# Altium schematic sheet Peripherals.SchDoc: Peripherals
size A4; Date: Not used; ApprovedBy: Not used; CheckedBy: Not used; Author: Not used; CompanyName: STMicroelectronics; DrawnBy: Not used; Engineer: Not used; Organization: Not used; Address1: Not used; Address2: Not used; Address3: Not used; Address4: Not used; DocumentNumber: Not used; Revision: Not used; SheetNumber: 14; SheetTotal: 22; CurrentTime: Not used; CurrentDate: Not used; Time: Not used; DocumentFullPathAndName: Not used; DocumentName: Not used; ModifiedDate: Not used; ImagePath: Not used; ProjectName: Not used; Application_BuildNumber: Not used
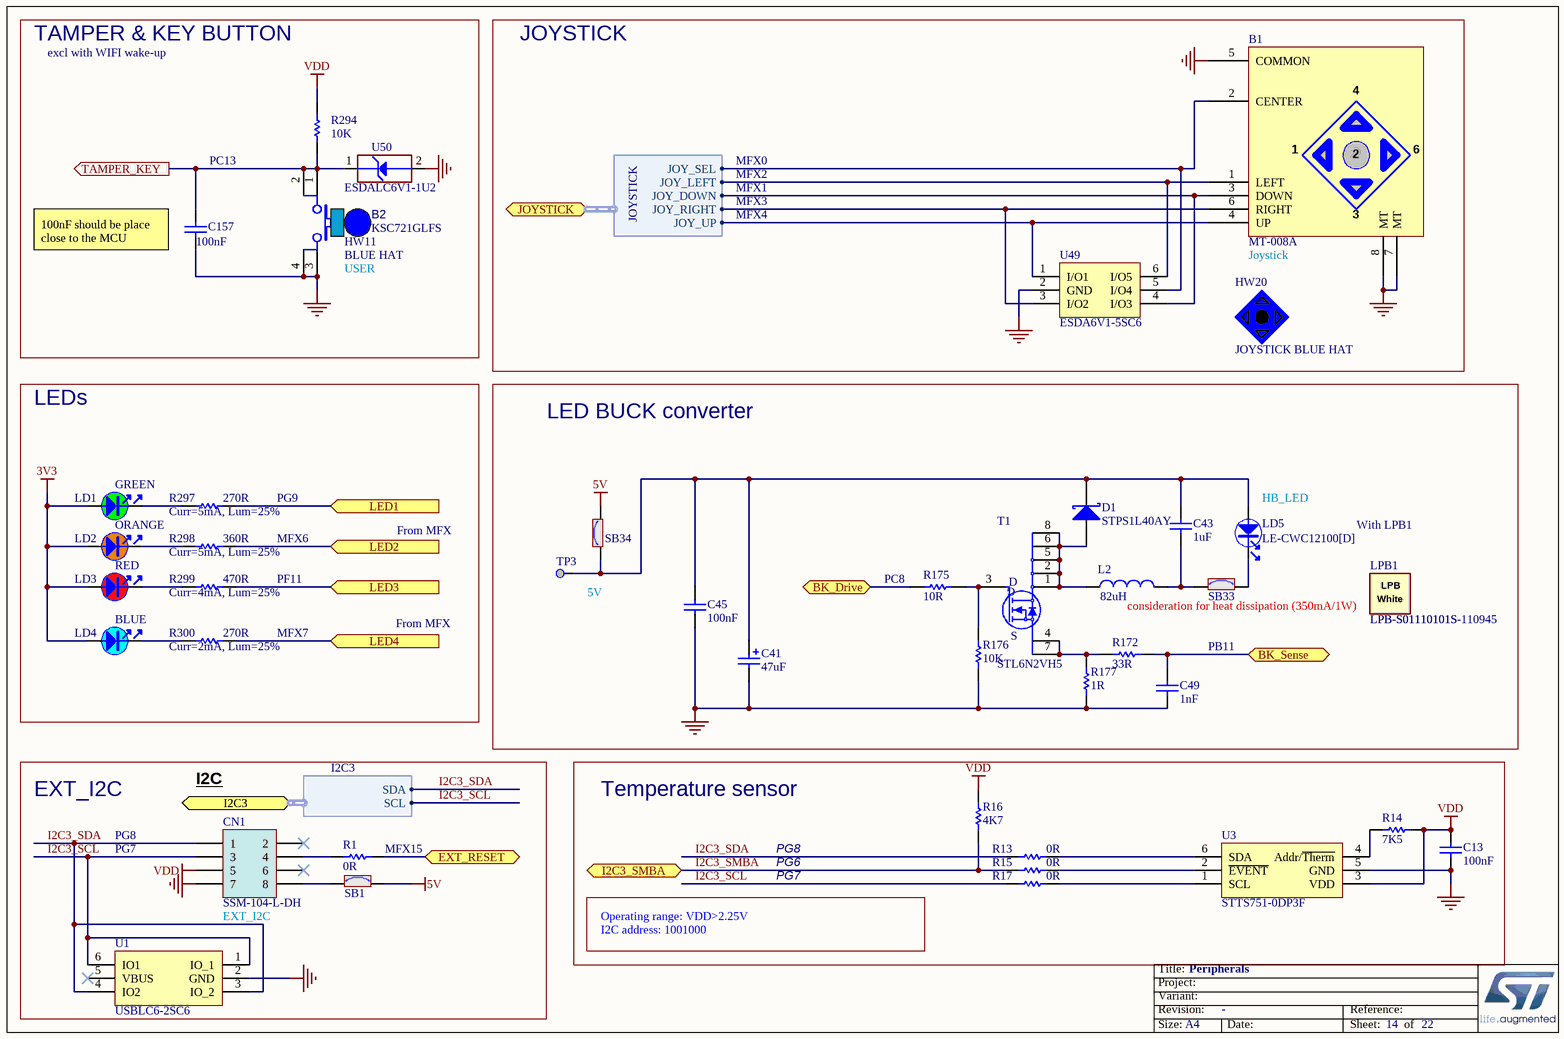
[diagram p0: Peripherals.SchDoc]

## Parts
B1  value MT-008A  [SWI_XIEJIA_MT-008A_6P]  (hidden comment: Joystick MT-008A_M)
B2  value KSC721GLFS  [SWI_C&K_KSC721GLFS_BLUE]  (hidden comment: SW_BLUE_KSC721GLFS)
C13  value 100nF  [C0603]  (hidden comment: Capacitor)
C41  value 47uF  [CPOL_TAJ-C_2312_H2P6]  (hidden comment: Cap_POL_TANA)
C43  value 1uF  [C0603]  (hidden comment: Capacitor)
C45  value 100nF  [C0603]  (hidden comment: Capacitor)
C49  value 1nF  [C0402]  (hidden comment: Capacitor)
C157  value 100nF  [C0402]  (hidden comment: Capacitor)
CN1  value SSM-104-L-DH  [CON_SAMTEC_SSM-104-L-DH]  (hidden comment: Socket 4x2)
D1  value STPS1L40AY  [DIO_SMA_1A_2K]  (hidden comment: SCHOTTKY)
HW11  value BLUE HAT  (hidden comment: BUTTON_HAT_BLUE)  (mechanical)
HW20  value JOYSTICK BLUE HAT  (hidden comment: JOYSTICK_BLUE_HAT)  (mechanical)
L2  value 82uH  [IND_POWER_CYNTEC_PSI054T]  (hidden comment: Inductor)
LD1  value GREEN  [LED_0603_OSRAM_LG-Q396-PS-35_GREEN_1A2K_H0P4]  (hidden comment: LED_green)
LD2  value ORANGE  [LED_0603_OSRAM_LO-Q976-PS-25_ORANGE_1A2K_H0P8]  (hidden comment: LED_orange)
LD3  value RED  [LED_0603_VISHAY_VLMS1300-GS08_RED_1A2K_H0P8]  (hidden comment: LED_red)
LD4  value BLUE  [LED_0603_OSRAM_LB-Q39G-L2OO-35-1_BLUE_1A2K_H0P4]  (hidden comment: LED_blue)
LD5  value LE-CWC12100[D]  [LED_EVERLUCK_CWC12100_WHITE_1A2K]  (hidden comment: LED_white)
LPB1  LPB-S01110101S  value LPB-S01110101S-110945  [LIGHT_10MM-SQUARE-LIGHT-BAR_LUMEX_LPB-S01110101S-110945]
R1  value 0R  [R0402]  (hidden comment: Resistor)
R13  value 0R  [R0603]  (hidden comment: Resistor)
R14  value 7K5  [R0603]  (hidden comment: Resistor)
R15  value 0R  [R0603]  (hidden comment: Resistor)
R16  value 4K7  [R0402]  (hidden comment: Resistor)
R17  value 0R  [R0603]  (hidden comment: Resistor)
R172  value 33R  [R0603]  (hidden comment: Resistor)
R175  value 10R  [R0805]  (hidden comment: Resistor)
R176  value 10K  [R0603]  (hidden comment: Resistor)
R177  value 1R  [R1206_H0P55]  (hidden comment: Resistor)
R294  value 10K  [R0402]  (hidden comment: Resistor)
R297  value 270R  [R0603]  (hidden comment: Resistor)
R298  value 360R  [R0603]  (hidden comment: Resistor)
R299  value 470R  [R0603]  (hidden comment: Resistor)
R300  value 270R  [R0603]  (hidden comment: Resistor)
SB1  SB_ON  [SOLDER-BRIDGE_R0603-0R]  (value not drawn)
SB33  SB_ON  [SOLDER-BRIDGE_R0603-0R]  (value not drawn)
SB34  SB_ON  [SOLDER-BRIDGE_R0603-0R]  (value not drawn)
T1  STL6N2VH5  [MOS_POWERFLAT_2X2_P065]
TP3  Test Point  [TP_SMD_1MM]  (value not drawn)  (no BOM)
U1  USBLC6-2SC6  [ESD_SOT23-6L]
U3  STTS751-0DP3F  [ICC_UDFN6_2X2_P065]
U49  ESDA6V1-5SC6  [ESD_SOT23-6L]
U50  value ESDALC6V1-1U2  [ESD_ST0201]  (hidden comment: ESD-TRANSIL)

## Blocks framed on the sheet
TAMPER & KEY BUTTON: B2 C157 HW11 R294 U50
JOYSTICK: B1 HW20 U49
LEDs: LD1-LD4 R297-R300
LED BUCK converter: C41 C43 C45 C49 D1 L2 LD5 LPB1 R172 R175-R177 SB33 SB34 T1 TP3
EXT_I2C: CN1 R1 SB1 U1
Temperature sensor: C13 R13-R17 U3

## Ports
BK_Drive, BK_Sense, EXT_RESET, I2C3 (harness I2C3), I2C3_SMBA, JOYSTICK (harness JOYSTICK), LED1 (in), LED2 (in), LED3 (in), LED4 (in), TAMPER_KEY (out)

## Harnesses
JOYSTICK: JOY_SEL, JOY_LEFT, JOY_DOWN, JOY_RIGHT, JOY_UP
I2C3: SDA, SCL

## Nets
3V3: LD1.1 LD2.1 LD3.1 LD4.1
5V: SB1.2 SB34.2
GND: B1.5(COMMON) B1.7(MT) B1.8(MT) B2.3 B2.4 C13.2 C41.2 C45.1 C49.1 C157.1 CN1.7 R176.1 R177.1 U1.2(GND) U3.5(GND) U49.2(GND) U50.2(GND)
VDD: C13.1 CN1.5 R14.2 R16.2 R294.2 U3.3(VDD)
BK_Drive: R175.1 ; port BK_Drive
BK_Sense: C49.2 R172.2 ; port BK_Sense
EXT_RESET: R1.2 ; port EXT_RESET
I2C3_SCL: CN1.3 R17.1 U1.1(IO_1) U1.6(IO1) ; port I2C3.SCL
I2C3_SDA: CN1.1 R13.1 U1.3(IO_2) U1.4(IO2) ; port I2C3.SDA
I2C3_SMBA: R15.1 R16.1 ; port I2C3_SMBA
LED1: R297.2 ; port LED1
LED2: R298.2 ; port LED2
LED3: R299.2 ; port LED3
LED4: R300.2 ; port LED4
TAMPER_KEY: B2.1 B2.2 C157.2 R294.1 U50.1(IO1) ; port TAMPER_KEY
NetB1_1: B1.1(LEFT) U49.6(I/O5) ; port JOYSTICK.JOY_LEFT
NetB1_2: B1.2(CENTER) U49.5(I/O4) ; port JOYSTICK.JOY_SEL
NetB1_3: B1.3(DOWN) U49.4(I/O3) ; port JOYSTICK.JOY_DOWN
NetB1_4: B1.4(UP) U49.1(I/O1) ; port JOYSTICK.JOY_UP
NetB1_6: B1.6(RIGHT) U49.3(I/O2) ; port JOYSTICK.JOY_RIGHT
NetC41_1: C41.1 C43.2 C45.2 D1.2(K) LD5.1 SB34.1 TP3.1
NetC43_1: C43.1 L2.2 SB33.1
NetCN1_4: CN1.4 R1.1
NetCN1_8: CN1.8 SB1.1
NetD1_1: D1.1(A) L2.1 T1.1(D) T1.2(D) T1.5(D) T1.6(D) T1.8(D)
NetLD1_2: LD1.2 R297.1
NetLD2_2: LD2.2 R298.1
NetLD3_2: LD3.2 R299.1
NetLD4_2: LD4.2 R300.1
NetLD5_2: LD5.2 SB33.2
NetR13_2: R13.2 U3.6(SDA)
NetR14_1: R14.1 U3.4(Addr/~{Therm})
NetR15_2: R15.2 U3.2(~{EVENT})
NetR17_2: R17.2 U3.1(SCL)
NetR172_1: R172.1 R177.2 T1.4(S) T1.7(S)
NetR175_2: R175.2 R176.2 T1.3(G)

Not connected (* = marked no-connect by the designer): CN1 2* 6*; U1 5(VBUS)*

## Notes on the sheet
- excl with WIFI wake-up
- PC13
- MFX2
- MFX0
- (near C157) 100nF should be place close to the MCU
- MFX1
- MFX3
- MFX4
- (near B2) USER
- (near B1) Joystick
- (near R297) Curr=5mA, Lum=25%
- PG9
- (near LD5) HB_LED
- (near R298) Curr=5mA, Lum=25%
- MFX6
- PF11
- From MFX
- (near R175) PC8
- (near LPB1) With LPB1
- (near R299) Curr=4mA, Lum=25%
- (near R300) Curr=2mA, Lum=25%
- MFX7
- 5V
- consideration for heat dissipation (350mA/1W)
- PB11
- I2C
- PG8
- PG7
- (near R1) MFX15
- EXT_I2C
- Operating range: VDD>2.25V
- PG6
- I2C address: 1001000
- Title:
- Project:
- Size:
- Revision:
- Variant:
- A4
- -
- Date:
- Reference:
- Sheet:
- of
- (in symbol MCD-01191) LPB; White

## Library data of the parts
B1 = MCD-00132: Joystick, 4 dir, 1 OK; Part_Type: Misc; Manufacturer: XIEJIA Electronics; Provided_By: SUBCO; Initial_Board_Reference: MB1262; Path: ws/MCD_ApplicationBoards/Lists/MCDPARTSdatabase; Item Type: Item; Internal_Part_Number: MCD-00132; Status: Released; Manufacturer_Part_Number: MT-008A; ComponentLink1Description: Datasheet; ComponentLink1URL: http://tunmcdsvn.tun.st.com/Component_Datasheet_Library/Trunk/Misc/Xieja electronics_MT-008A
B2 = MCD-00176: Switch HW BLUE High4.3mm 2.25 Newtons; Manufacturer: C&K; Part_Type: Misc; Provided_By: SUBCO; Initial_Board_Reference: MB1274; Path: ws/MCD_ApplicationBoards/Lists/MCDPARTSdatabase; Item Type: Item; Internal_Part_Number: MCD-00176; Manufacturer_Part_Number: KSC721GLFS; Status: Released; ComponentLink1Description: Datasheet; ComponentLink1URL: http://tunmcdsvn.tun.st.com/Component_Datasheet_Library/Trunk/Misc/C&K_tactile_switch_KSC_series
C13 C45 = MCD-00211: Capacitor, MLCC, 100nF, 16V, X7R, 10%, 0603, T=0,8mm; Manufacturer_Part_Number: CC0603KRX7R7BB104; Manufacturer: YAGEO; Provided_By: SUBCO; Initial_Board_Reference: MB1319; Path: ws/MCD_ApplicationBoards/Lists/MCDPARTSdatabase; Item Type: Item; Internal_Part_Number: MCD-00211; Status: Released; Part_Type: Capacitor; Package: C0603; ComponentLink1Description: Datasheet; ComponentLink1URL: http://tunmcdsvn.tun.st.com/Component_Datasheet_Library/Trunk/Capacitors/Yageo_Multilayer_Capacitor_X7R_series_100pF_to_22uF
C41 = MCD-00559: Capacitor, Tantalum, 47uF, 16V, 10%, TypeC; Manufacturer_Part_Number: TAJC476K016RNJ; Manufacturer: AVX; Provided_By: SUBCO; Initial_Board_Reference: MB1331; Path: ws/MCD_ApplicationBoards/Lists/MCDPARTSdatabase; Item Type: Item; Revision: July-2002: Re-released for DXP Platform.; Internal_Part_Number: MCD-00559; Status: Footprint available; Part_Type: Capacitor; Package: C2312; ComponentLink1Description: Datasheet; ComponentLink1URL: http://tunmcdsvn.tun.st.com/Component_Datasheet_Library/Trunk/Capacitors/AVX_Capacitor_TAJ-series
C43 = MCD-00010: Capacitor, MLCC, 1uF, 16V, X5R, 10%, 0603, T=0,8mm; Manufacturer_Part_Number: CC0603KRX5R7BB105; Manufacturer: YAGEO; Provided_By: SUBCO; Initial_Board_Reference: MB1274; Path: ws/MCD_ApplicationBoards/Lists/MCDPARTSdatabase; Item Type: Item; Internal_Part_Number: MCD-00010; Status: Released; Part_Type: Capacitor; Package: C0603; ComponentLink1Description: Datasheet; ComponentLink1URL: http://tunmcdsvn.tun.st.com/Component_Datasheet_Library/Trunk/Capacitors/Yageo_Multilayer_capacitor_X5R_series_100pF_to_100uF
C49 = MCD-00198: Capacitor, MLCC, 1nF, 16V, X7R, 10%, 0402, T=0.5mm; Manufacturer_Part_Number: CC0402KRX7R7BB102; Manufacturer: YAGEO; Provided_By: SUBCO; Initial_Board_Reference: MBxxxx; Path: ws/MCD_ApplicationBoards/Lists/MCDPARTSdatabase; Item Type: Item; Internal_Part_Number: MCD-00198; Status: Released; Part_Type: Capacitor; Package: C0402; ComponentLink1Description: Datasheet; ComponentLink1URL: http://tunmcdsvn.tun.st.com/Component_Datasheet_Library/Trunk/Capacitors/Yageo_Multilayer_Capacitor_X7R_series_100pF_to_22uF
C157 = MCD-00006: Capacitor, MLCC, 100nF, 16V, X7R, 10%, 0402, T=0.5mm; Manufacturer_Part_Number: CC0402KRX7R7BB104; Manufacturer: YAGEO; Alternate_Manufacturer_Part_Number: GCM155R71C104KA55D; Alternate_Manufacturer: MURATA; Provided_By: SUBCO; Initial_Board_Reference: MB1274; Path: ws/MCD_ApplicationBoards/Lists/MCDPARTSdatabase; Item Type: Item; Internal_Part_Number: MCD-00006; ComponentLink1Description: Datasheet; Status: Released; Package: C0402; Part_Type: Capacitor; ComponentLink1URL: http://tunmcdsvn.tun.st.com/Component_Datasheet_Library/Trunk/Capacitors/Yageo_Multilayer_Capacitor_X7R_series_100pF_to_22uF
CN1 = MCD-00131: Socket, 4x2, 2.54mm, RA, SMT, Height 5.72mm; Manufacturer: SAMTEC; Part_Type: Connector; Provided_By: SUBCO; Initial_Board_Reference: MB1262; Path: ws/MCD_ApplicationBoards/Lists/MCDPARTSdatabase; Item Type: Item; Internal_Part_Number: MCD-00131; Manufacturer_Part_Number: SSM-104-L-DH; ComponentLink1Description: Datasheet; Status: Released; ComponentLink1URL: http://tunmcdsvn.tun.st.com/Component_Datasheet_Library/Trunk/Connectors/Samtec_SSM_series
D1 = MCD-00606: Low Drop power Schottky rectifier(1A, 40V, 0.37 V); Part_Type: Diode; Manufacturer: STMICROELECTRONICS; BMS_Part_Number: 9151017; Provided_By: SUBCO with ST control; Initial_Board_Reference: MB1370; Path: ws/MCD_ApplicationBoards/Lists/MCDPARTSdatabase; Item Type: Item; Internal_Part_Number: MCD-00606; Status: Checked; Manufacturer_Part_Number: STPS1L40AY; Package: SMA; ComponentLink1Description: Datasheet; ComponentLink1URL: http://tunmcdsvn.tun.st.com/Component_Datasheet_Library/Trunk/Diodes/STM_SCHOTTKY_STPS1L40AY
HW11 = MCD-00634: Blue Hat for switch TD0341X-G01-BLU; Part_Type: Mechanical; Manufacturer_Part_Number: 988.16.09.3.00002_SH-517; Manufacturer: JIUBABA; Provided_By: SUBCO; Initial_Board_Reference: MB1319; Path: ws/MCD_ApplicationBoards/Lists/MCDPARTSdatabase; Item Type: Item; Internal_Part_Number: MCD-00634; Status: Released; ComponentLink1Description: Datasheet; ComponentLink1URL: http://tunmcdsvn.tun.st.com/Component_Datasheet_Library/Trunk/Mechanical/Jiubaba_HAT_SH-517
HW20 = MCD-01337: Joystick BLue Hat; Part_Type: Mechanical; Manufacturer_Part_Number: KTSC-62-B; Manufacturer: JIUBABA; Provided_By: SUBCO; Initial_Board_Reference: MB1372; Remark: mechanical part only no footprint; Item Type: Item; Path: ws/MCD_ApplicationBoards/Lists/MCDPARTSdatabase; Internal_Part_Number: MCD-01337; Status: Checked; ComponentLink1Description: Datasheet; ComponentLink1URL: http://tunmcdsvn.tun.st.com/Component_Datasheet_Library/Trunk/Mechanical/JIUBABA_JOYSTICK_HAT_KTSC-62
L2 = MCD-01190: SMD power inductor. 82uH, 1.0A, 400mohm, 4.9x4.9x4.0mm; Manufacturer_Part_Number: PSI054T-820MS-11; Manufacturer: CYNTEC; Provided_By: SUBCO; Initial_Board_Reference: MB1397; Path: ws/MCD_ApplicationBoards/Lists/MCDPARTSdatabase; Item Type: Item; Internal_Part_Number: MCD-01190; Status: Checked; Part_Type: Inductor; ComponentLink1Description: Datasheet; ComponentLink1URL: http://tunmcdsvn.tun.st.com/Component_Datasheet_Library/Trunk/Inductors/CYNTEC_Inductor_PSI054T
LD1 = MCD-00588: LED Green, 0603 SMD, Forward Voltage Typ=2V, Max=2.5V; Part_Type: Display; Manufacturer_Part_Number: LG Q396-PS-35; Manufacturer: OSRAM OPTO SEMICONDUCTORS; Alternate_Manufacturer_Part_Number: VLMTG1300-GS08; Alternate_Manufacturer: VISHAY SEMICONDUCTOR OPTO DIVISION; Provided_By: SUBCO; Initial_Board_Reference: MB1331; Path: ws/MCD_ApplicationBoards/Lists/MCDPARTSdatabase; Item Type: Item; Internal_Part_Number: MCD-00588; Status: Released; Package: LED 0603; ComponentLink1Description: Datasheet; ComponentLink1URL: http://tunmcdsvn.tun.st.com/Component_Datasheet_Library/Trunk/Display/OSRAM_LED_GREEN_LG Q396-PS-35; Order_Code_Digikey: LG Q396-PS-35-ND
LD2 = MCD-00590: LED Orange, 0603 SMD, Forward Voltage Min=1.6V, Max=2.4V; Part_Type: Display; Manufacturer_Part_Number: LO Q976-PS-25; Manufacturer: OSRAM OPTO SEMICONDUCTORS; Alternate_Manufacturer_Part_Number: VLMO1300-GS08; Alternate_Manufacturer: VISHAY SEMICONDUCTOR OPTO DIVISION; Provided_By: SUBCO; Initial_Board_Reference: MB1331; Path: ws/MCD_ApplicationBoards/Lists/MCDPARTSdatabase; Item Type: Item; Internal_Part_Number: MCD-00590; Status: Released; Package: LED 0603; ComponentLink1Description: Datasheet; ComponentLink1URL: http://tunmcdsvn.tun.st.com/Component_Datasheet_Library/Trunk/Display/OSRAM_LED_ORANGE_LO Q976-PS-25
LD3 = MCD-00587: LED Red, 0603 SMD, 2V Forward Voltage; Part_Type: Display; Manufacturer_Part_Number: VLMS1300-GS08; Manufacturer: VISHAY; Alternate_Manufacturer_Part_Number: LS Q976-NR-1; Alternate_Manufacturer: OSRAM OPTO SEMICONDUCTORS; Provided_By: SUBCO; Initial_Board_Reference: MB1331; Path: ws/MCD_ApplicationBoards/Lists/MCDPARTSdatabase; Item Type: Item; Internal_Part_Number: MCD-00587; Status: Released; Package: LED 0603; ComponentLink1Description: Datasheet; ComponentLink1URL: http://tunmcdsvn.tun.st.com/Component_Datasheet_Library/Trunk/Display/VISHAY_LED_RED_VLMS1300-GS08; Order_Code_Digikey: VLMS1300-GS08CT-ND; Order_Code_Farnell: 2078728
LD4 = MCD-00585: LED Blue, 0603 SMD, Forward Voltage Min=2,8V, Max=3,8V; Part_Type: Display; Manufacturer_Part_Number: LB Q39G-L2OO-35-1; Manufacturer: OSRAM OPTO SEMICONDUCTORS; Order_Code_RS: 9148643; Provided_By: SUBCO; Initial_Board_Reference: MB1331; Path: ws/MCD_ApplicationBoards/Lists/MCDPARTSdatabase; Item Type: Item; Internal_Part_Number: MCD-00585; Status: Checked; Package: LED 0603; ComponentLink1Description: Datasheet; ComponentLink1URL: http://tunmcdsvn.tun.st.com/Component_Datasheet_Library/Trunk/Display/OSRAM_LED_BLUE_LB Q39G-L2OO-35-1; Order_Code_Digikey: 475-2816-1-ND
LD5 = MCD-01186: White SMD LED lamp, Forward Voltage Typ=2.8V, Max=3.6V; Part_Type: Display; Manufacturer: EVERLUCK; Provided_By: SUBCO; Initial_Board_Reference: MB1397; Path: ws/MCD_ApplicationBoards/Lists/MCDPARTSdatabase; Item Type: Item; Internal_Part_Number: MCD-01186; Status: Footprint available; Manufacturer_Part_Number: LE-CWC12100[D]; ComponentLink1Description: Datasheet; ComponentLink1URL: http://tunmcdsvn.tun.st.com/Component_Datasheet_Library/Trunk/Display/Everluck_LED_CWC12100
LPB1 = MCD-01191: 10mm Square Light Bar.; Part_Type: Misc; Manufacturer: LUMEX; Provided_By: SUBCO; Initial_Board_Reference: MB1397; Remark: LED pad removed. Please validat.; Path: ws/MCD_ApplicationBoards/Lists/MCDPARTSdatabase; Item Type: Item; Internal_Part_Number: MCD-01191; Status: Checked; Manufacturer_Part_Number: LPB-S01110101S-110945; ComponentLink1Description: Datasheet; ComponentLink1URL: http://tunmcdsvn.tun.st.com/Component_Datasheet_Library/Trunk/Misc/LUMEX_LPB-S01110101S
R1 = MCD-00052: Resistor,0R,0402,5%,1/16W; Manufacturer_Part_Number: RC0402JR-070RL; Manufacturer: YAGEO; Provided_By: SUBCO; Initial_Board_Reference: MB1274; Path: ws/MCD_ApplicationBoards/Lists/MCDPARTSdatabase; Item Type: Item; Internal_Part_Number: MCD-00052; Status: Released; Part_Type: Resistor; Package: R0402; ComponentLink1Description: Datasheet; ComponentLink1URL: http://tunmcdsvn.tun.st.com/Component_Datasheet_Library/Trunk/Resistors/Yageo_Resistor_RC0402-series
R13 R15 R17 = MCD-00056: Resistor,0R,0603,5%,1/10W; Manufacturer_Part_Number: RC0603JR-070RL; Manufacturer: YAGEO; Provided_By: SUBCO; Initial_Board_Reference: MB1274; Path: ws/MCD_ApplicationBoards/Lists/MCDPARTSdatabase; Item Type: Item; Internal_Part_Number: MCD-00056; Status: Released; Part_Type: Resistor; Package: R0603; ComponentLink1Description: Datasheet; ComponentLink1URL: http://tunmcdsvn.tun.st.com/Component_Datasheet_Library/Trunk/Resistors/Yageo_Resistor_RC0603-series
R14 = MCD-00520: Resistor,7K5,0603,1%,1/10W; Manufacturer_Part_Number: RC0603FR-077K5L; Manufacturer: YAGEO; Provided_By: SUBCO; Initial_Board_Reference: MBxxxx; Path: ws/MCD_ApplicationBoards/Lists/MCDPARTSdatabase; Item Type: Item; Internal_Part_Number: MCD-00520; Status: Released; Part_Type: Resistor; Package: R0603; ComponentLink1Description: Datasheet; ComponentLink1URL: http://tunmcdsvn.tun.st.com/Component_Datasheet_Library/Trunk/Resistors/Yageo_Resistor_RC0603-series
R16 = MCD-00065: Resistor,4K7,0402,1%,1/16W; Manufacturer_Part_Number: RC0402FR-074K7L; Manufacturer: YAGEO; Alternate_Manufacturer_Part_Number: RT0402FRE074K7L; Provided_By: SUBCO; Initial_Board_Reference: MB1274; Path: ws/MCD_ApplicationBoards/Lists/MCDPARTSdatabase; Item Type: Item; Internal_Part_Number: MCD-00065; Status: Released; Part_Type: Resistor; Package: R0402; ComponentLink1Description: Datasheet; ComponentLink1URL: http://tunmcdsvn.tun.st.com/Component_Datasheet_Library/Trunk/Resistors/Yageo_Resistor_RC0402-series; Alternate_Manufacturer: YAGEO
R172 = MCD-00456: Resistor,33R,0603,1%,1/10W; Manufacturer_Part_Number: RC0603FR-0733RL; Manufacturer: YAGEO; BMS_Part_Number: 9129732; Provided_By: SUBCO; Initial_Board_Reference: MBxxxx; Path: ws/MCD_ApplicationBoards/Lists/MCDPARTSdatabase; Item Type: Item; Internal_Part_Number: MCD-00456; Status: Released; Part_Type: Resistor; Package: R0603; ComponentLink1Description: Datasheet; ComponentLink1URL: http://tunmcdsvn.tun.st.com/Component_Datasheet_Library/Trunk/Resistors/Yageo_Resistor_RC0603-series
R175 = MCD-01111: Resistor,10R,0805,1%,Stackpole,1/4W; Manufacturer_Part_Number: RNCP0805FTD10R0; Provided_By: SUBCO; Initial_Board_Reference: MB1381; Path: ws/MCD_ApplicationBoards/Lists/MCDPARTSdatabase; Item Type: Item; Internal_Part_Number: MCD-01111; Status: Footprint available; Part_Type: Resistor; Manufacturer: STACKPOLE; Package: R0805; ComponentLink1Description: Datasheet; ComponentLink1URL: http://tunmcdsvn.tun.st.com/Component_Datasheet_Library/Trunk/Resistors/Stackpole_Resisteor_RNCP%20Series/Stackpole_Resisteor_RNCP%20Series.pdf
R176 = MCD-00220: Resistor,10K,0603,1%,1/10W; Manufacturer_Part_Number: RC0603FR-0710KL; Manufacturer: YAGEO; Provided_By: SUBCO; Initial_Board_Reference: MB1319; Path: ws/MCD_ApplicationBoards/Lists/MCDPARTSdatabase; Item Type: Item; Internal_Part_Number: MCD-00220; Status: Released; Part_Type: Resistor; Package: R0603; ComponentLink1Description: Datasheet; ComponentLink1URL: http://tunmcdsvn.tun.st.com/Component_Datasheet_Library/Trunk/Resistors/Yageo_Resistor_RC0603-series
R177 = MCD-01185: Resistor, 1R, 1206, 1%, 1/4W; Manufacturer_Part_Number: CRCW12061R00FKEA; Manufacturer: VISHAY; Provided_By: SUBCO; Initial_Board_Reference: MB1397; Remark: update footprint name; Path: ws/MCD_ApplicationBoards/Lists/MCDPARTSdatabase; Item Type: Item; Internal_Part_Number: MCD-01185; Status: Checked; Part_Type: Resistor; Package: R1206; ComponentLink1Description: Datasheet; ComponentLink1URL: http://tunmcdsvn.tun.st.com/Component_Datasheet_Library/Trunk/Resistors/VISHAY_Resistor_dcrcwe3-series
R294 = MCD-00053: Resistor,10K,0402,1%,1/16W; Manufacturer_Part_Number: RC0402FR-0710KL; Manufacturer: YAGEO; Provided_By: SUBCO; Initial_Board_Reference: MB1274; Path: ws/MCD_ApplicationBoards/Lists/MCDPARTSdatabase; Item Type: Item; Internal_Part_Number: MCD-00053; ComponentLink1Description: Datasheet; Status: Released; Part_Type: Resistor; Package: R0402; ComponentLink1URL: http://tunmcdsvn.tun.st.com/Component_Datasheet_Library/Trunk/Resistors/Yageo_Resistor_RC0402-series
R297 R300 = MCD-00442: Resistor,270R,0603,1%,1/10W; Manufacturer_Part_Number: RC0603FR-07270RL; Manufacturer: YAGEO; Provided_By: SUBCO; Initial_Board_Reference: MBxxxx; Path: ws/MCD_ApplicationBoards/Lists/MCDPARTSdatabase; Item Type: Item; Internal_Part_Number: MCD-00442; Status: Released; Part_Type: Resistor; Package: R0603; ComponentLink1Description: Datasheet; ComponentLink1URL: http://tunmcdsvn.tun.st.com/Component_Datasheet_Library/Trunk/Resistors/Yageo_Resistor_RC0603-series
R298 = MCD-00462: Resistor,360R,0603,1%,1/10W; Manufacturer_Part_Number: RC0603FR-07360RL; Manufacturer: YAGEO; BMS_Part_Number: 9129744; Provided_By: SUBCO; Initial_Board_Reference: MBxxxx; Path: ws/MCD_ApplicationBoards/Lists/MCDPARTSdatabase; Item Type: Item; Internal_Part_Number: MCD-00462; Status: Released; Part_Type: Resistor; Package: R0603; ComponentLink1Description: Datasheet; ComponentLink1URL: http://tunmcdsvn.tun.st.com/Component_Datasheet_Library/Trunk/Resistors/Yageo_Resistor_RC0603-series
R299 = MCD-00354: Resistor,470R,0603,1%,1/10W; Manufacturer_Part_Number: RC0603FR-07470RL; Manufacturer: YAGEO; BMS_Part_Number: 9129906; Provided_By: SUBCO; Initial_Board_Reference: MBxxxx; Path: ws/MCD_ApplicationBoards/Lists/MCDPARTSdatabase; Item Type: Item; Internal_Part_Number: MCD-00354; Status: Released; Part_Type: Resistor; Package: R0603; ComponentLink1Description: Datasheet; ComponentLink1URL: http://tunmcdsvn.tun.st.com/Component_Datasheet_Library/Trunk/Resistors/Yageo_Resistor_RC0603-series
SB1 SB33 SB34 = MCD-00071: Solder Bridge ON; Part_Type: Mechanical; Manufacturer_Part_Number: RC0603JR-070RL; Manufacturer: YAGEO; Provided_By: SUBCO; Initial_Board_Reference: MB1274; Path: ws/MCD_ApplicationBoards/Lists/MCDPARTSdatabase; Item Type: Item; Internal_Part_Number: MCD-00071; Status: Released; ComponentLink1Description: Datasheet; Package: SB0603; ComponentLink1URL: http://tunmcdsvn.tun.st.com/Component_Datasheet_Library/Trunk/Resistors/Yageo_Resistor_RC0603-series
T1 = MCD-01028: N-channel 20 V, 0.025 O typ., 6 A STripFET™ V Power MOSFET in a PowerFLAT™ 2x2 package; Part_Type: IC; Manufacturer: STMICROELECTRONICS; BMS_Part_Number: 9153558; Provided_By: SUBCO with ST control; Initial_Board_Reference: MB1378; Remark: Update with official footprint according to layout rules; Path: ws/MCD_ApplicationBoards/Lists/MCDPARTSdatabase; Item Type: Item; Internal_Part_Number: MCD-01028; Value: STL6N2VH5; Status: Checked; Manufacturer_Part_Number: STL6N2VH5; Package: PowerFLAT 2x2; ComponentLink1Description: Datasheet; ComponentLink1URL: http://tunmcdsvn.tun.st.com/Component_Datasheet_Library/Trunk/IC/STM_POWER_MOSFET_N_STL6N2VH5
TP3 = MCD-00074: Test Point 1mm; Part_Type: Mechanical; Initial_Board_Reference: MB1274; Path: ws/MCD_ApplicationBoards/Lists/MCDPARTSdatabase; Item Type: Item; Internal_Part_Number: MCD-00074; Provided_By: n/a; Status: Released; ComponentLink1Description: Datasheet; ComponentLink1URL: http://na; Manufacturer: n/a; Manufacturer_Part_Number: n/a
U1 = MCD-00163: Very low capacitance ESD protection; Part_Type: IC; Manufacturer: STMICROELECTRONICS; BMS_Part_Number: 9151075; Provided_By: SUBCO with ST control; Initial_Board_Reference: MB1263; Path: ws/MCD_ApplicationBoards/Lists/MCDPARTSdatabase; Item Type: Item; Internal_Part_Number: MCD-00163; Value: USBLC6-2SC6; Status: Released; Manufacturer_Part_Number: USBLC6-2SC6; ComponentLink1Description: Datasheet; ComponentLink1URL: http://tunmcdsvn.tun.st.com/Component_Datasheet_Library/Trunk/Diodes/STM_ESD_USBLC6-2
U3 = MCD-01551: IC, 2.25 V low-voltage local digital temperature sensor, UDFN-6L; Manufacturer: STMICROELECTRONICS; Provided_By: SUBCO with ST control; Initial_Board_Reference: MB1397; Path: ws/MCD_ApplicationBoards/Lists/MCDPARTSdatabase; Item Type: Item; Internal_Part_Number: MCD-01551; Value: STTS751-0DP3F; Status: Footprint available; Part_Type: IC; Manufacturer_Part_Number: STTS751-0DP3F; ComponentLink1Description: Datasheet; ComponentLink1URL: http://tunmcdsvn.tun.st.com/Component_Datasheet_Library/Trunk/IC/STM_STTS751; Package: UDFN-6L
U49 = MCD-01066: 5 unidirectional Transil diodes ESD protection; Part_Type: Diode; Manufacturer: STMICROELECTRONICS; BMS_Part_Number: 9179044; Provided_By: SUBCO with ST control; Initial_Board_Reference: MB1331; Path: ws/MCD_ApplicationBoards/Lists/MCDPARTSdatabase; Item Type: Item; Internal_Part_Number: MCD-01066; Value: ESDA6V1-5SC6; Status: Released; Manufacturer_Part_Number: ESDA6V1-5SC6; Package: SOT23-6L; ComponentLink1Description: Datasheet; ComponentLink1URL: http://tunmcdsvn.tun.st.com/Component_Datasheet_Library/Trunk/Diodes/STM_ESD_ESDA6V1_5SC6
U50 = MCD-00170: ESD protection 6V1; Part_Type: Diode; Manufacturer: STMICROELECTRONICS; BMS_Part_Number: 9151132; Provided_By: SUBCO with ST control; Initial_Board_Reference: MB1274; Path: ws/MCD_ApplicationBoards/Lists/MCDPARTSdatabase; Item Type: Item; Internal_Part_Number: MCD-00170; Status: Released; Manufacturer_Part_Number: ESDALC6V1-1U2; ComponentLink1Description: Datasheet; ComponentLink1URL: http://tunmcdsvn.tun.st.com/Component_Datasheet_Library/Trunk/Diodes/STM_ESD_ESDALC6V1-1U2